# EAGLE design FiltreFSK_TI_LM386 (EAGLE 6.4)
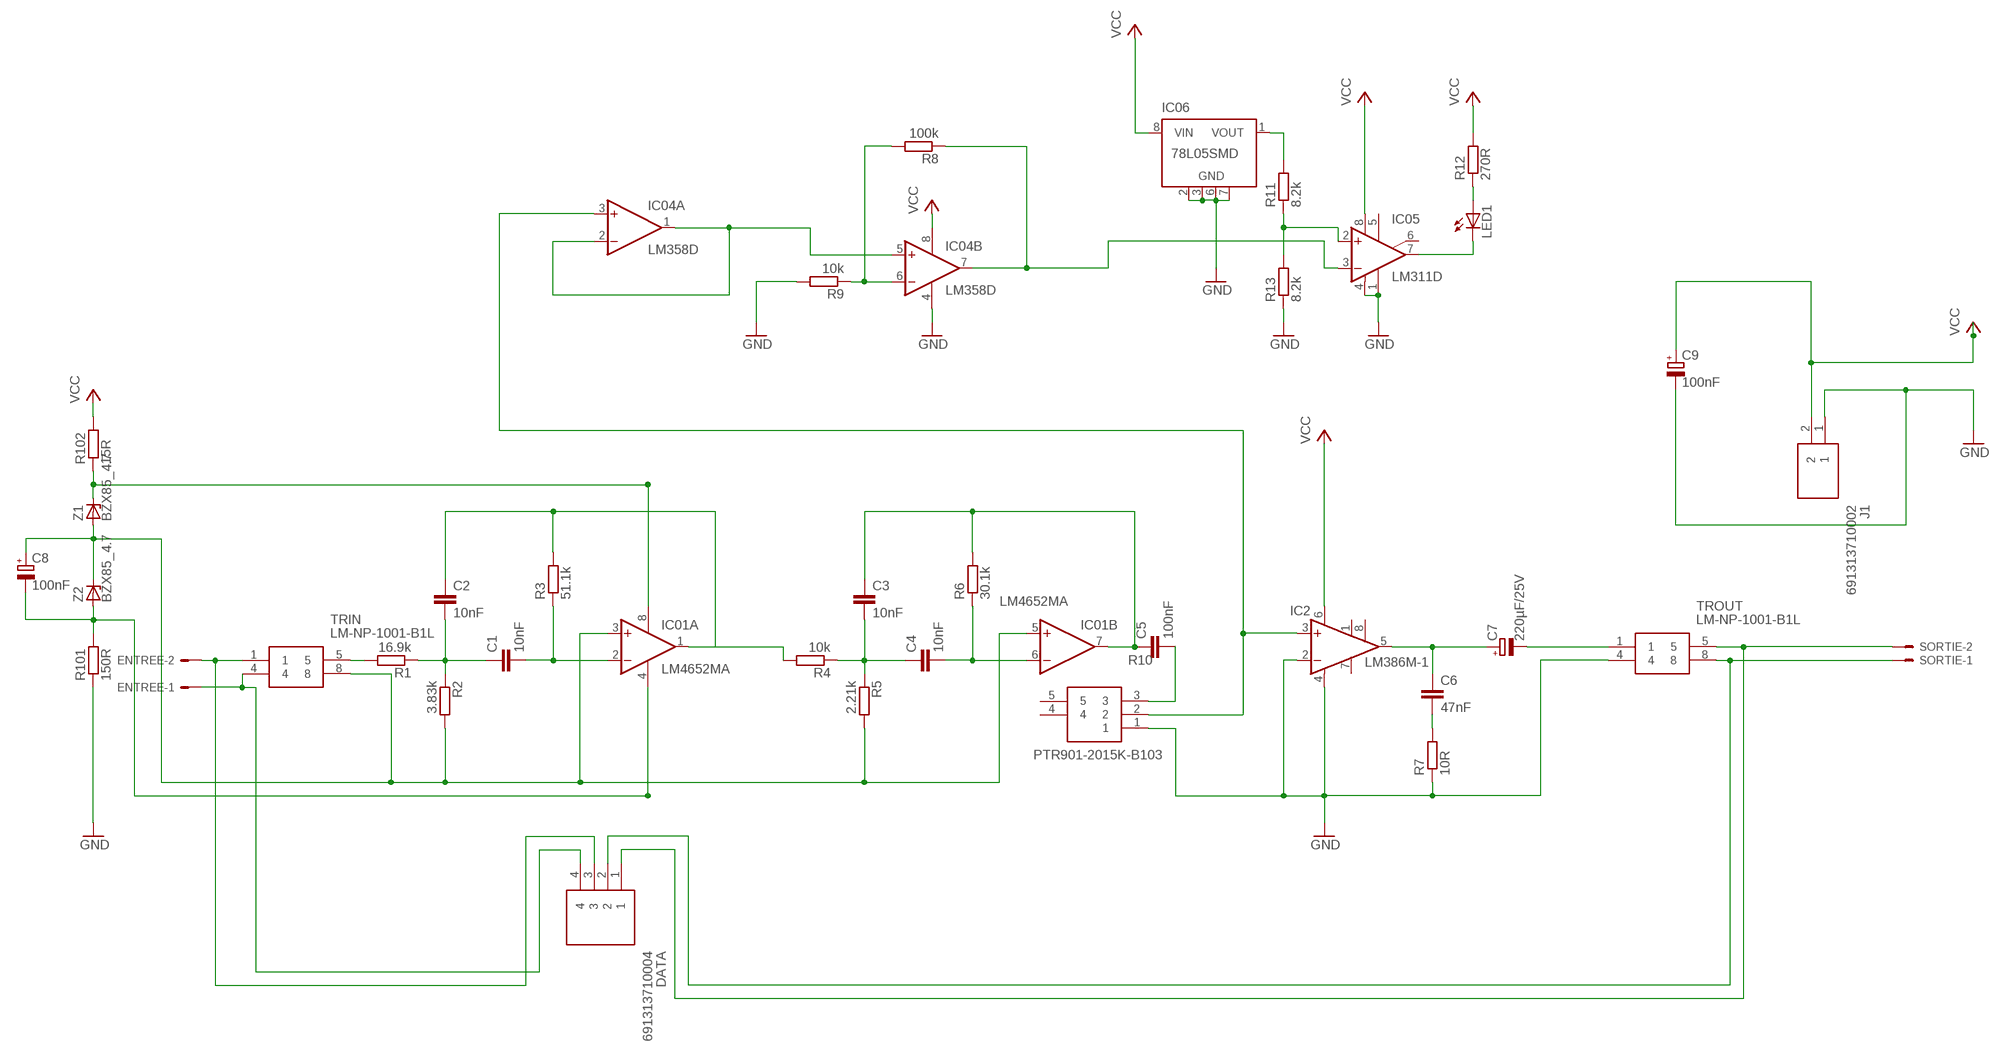
[diagram p0: schematic, sheet 1]

## Parts
C1  10nF  C-EUC1206  [C1206]
C2  10nF  C-EUC1206  [C1206]
C3  10nF  C-EUC1206  [C1206]
C4  10nF  C-EUC1206  [C1206]
C5  100nF  C-EUC1206  [C1206]
C6  47nF  C-EUC1206  [C1206]
C7  220µF/25V  CPOL-EUE3.5-8  [E3,5-8]
C8  100nF  CPOL-EUE5-10.5  [E5-10,5]
C9  100nF  CPOL-EUE5-10.5  [E5-10,5]
DATA  691313710004  [SHDR4W140P0X500_1X4_2200X1200X]
ENTREE  KK-156-2  [KK-156-2]
IC01  LM4652MA  LM358D  [SO08]
IC2  LM386M-1  [SO08]
IC04  LM358D  [SO08]
IC05  LM311D  [SO08]
IC06  78L05SMD  [SO08]
J1  691313710002  [691313710002]
LED1  LED5MM  [LED5MM]
R1  16.9k  R-EU_R1206  [R1206]
R2  3.83k  R-EU_R1206  [R1206]
R3  51.1k  R-EU_R1206  [R1206]
R4  10k  R-EU_R1206  [R1206]
R5  2.21k  R-EU_R1206  [R1206]
R6  30.1k  R-EU_R1206  [R1206]
R7  10R  R-EU_R1206  [R1206]
R8  100k  R-EU_R1206  [R1206]
R9  10k  R-EU_R1206  [R1206]
R10  PTR901-2015K-B103  [PTR9012015KB103]
R11  8.2k  R-EU_R1210  [R1210]
R12  270R  R-EU_R1206  [R1206]
R13  8.2k  R-EU_R1210  [R1210]
R101  150R  R-EU_0207/10  [0207/10]
R102  15R  R-EU_0207/10  [0207/10]
SORTIE  KK-156-2  [KK-156-2]
TRIN  LM-NP-1001-B1L  [LMNP1001B1L]
TROUT  LM-NP-1001-B1L  [LMNP1001B1L]
Z1  BZX85_4.7  BZX85  [DO41Z10]
Z2  BZX85_4.7  BZX85  [DO41Z10]

## Nets
GND: C9.- IC2.2(-IN) IC2.4(GND) IC04.4(P:V-) IC05.1(GND) IC05.4(V-) IC06.2(GND) IC06.3(GND) IC06.6(GND) IC06.7(GND) J1.1 R7.1 R9.2 R10.1 R13.1 R101.1 TROUT.4
N$1: DATA.3 ENTREE.2 TRIN.1
N$2: C8.+ IC01.3(A:+IN) IC01.5(B:+IN) R2.2 R5.2 TRIN.8 Z1.A Z2.C
N$3: C8.- IC01.4(P:V-) R101.2 Z2.A
N$4: C1.1 C2.2 R1.1 R2.1
N$5: C2.1 IC01.1(A:OUT) R3.2 R4.2
N$6: C1.2 IC01.2(A:-IN) R3.1
N$7: DATA.4 ENTREE.1 TRIN.4
N$8: IC2.3(+IN) IC04.3(A:+IN) R10.2
N$9: C6.2 R7.2
N$10: C5.2 R10.3
N$11: DATA.2 SORTIE.1 TROUT.8
N$12: C6.1 C7.+ IC2.5(OUT)
N$13: R1.2 TRIN.5
N$14: C7.- TROUT.1
N$16: IC04.7(B:OUT) IC05.3(-IN) R8.1
N$17: IC01.8(P:V+) R102.1 Z1.C
N$18: IC04.6(B:-IN) R8.2 R9.1
N$19: IC05.7(OUT) LED1.K(C)
N$20: LED1.A R12.1
N$21: IC06.1(VOUT) R11.2
N$22: DATA.1 SORTIE.2 TROUT.5
N$23: IC05.2(+IN) R11.1 R13.2
N$24: IC04.1(A:OUT) IC04.2(A:-IN) IC04.5(B:+IN)
N$30: C3.2 C4.1 R4.1 R5.1
N$31: C3.1 C5.1 IC01.7(B:OUT) R6.2
N$32: C4.2 IC01.6(B:-IN) R6.1
VCC: C9.+ IC2.6(VS) IC04.8(P:V+) IC05.8(V+) IC06.8(VIN) J1.2 R12.2 R102.2
Unconnected: IC2.1(GAIN) IC2.7(BYPASS) IC2.8(GAIN) IC05.5(ON) IC05.6(ON/STR) IC06.4(NC) IC06.5(NC) R10.4 R10.5

## Library data of the parts
C1-C6 = rcl:C-EU: CAPACITOR, European symbol
C7-C9 = rcl:CPOL-EU: POLARIZED CAPACITOR, European symbol
DATA = 691313710004:691313710004: WR-TBL Terminal block - serie 3137 Source: Datasheet <http://katalog.we-online.de/em/datasheet/6913137100xx.pdf>; DESCRIPTION: WR-TBL Terminal block - serie 3137; HEIGHT: 8.7mm; MANUFACTURER_NAME: Wurth Elektronik; MANUFACTURER_PART_NUMBER: 691313710004; MOUSER_PART_NUMBER: 710-691313710004; MOUSER_PRICE-STOCK: https://www.mouser.com/Search/Refine.aspx?Keyword=710-691313710004; RS_PART_NUMBER: 8246576; RS_PRICE-STOCK: http://uk.rs-online.com/web/p/products/8246576
ENTREE SORTIE = con-molex:KK-156-2: KK 156 HEADER Source: http://www.molex.com/pdm_docs/sd/026604100_sd.pdf; OC_FARNELL: unknown; OC_NEWARK: unknown
IC01 IC04 = linear:LM358: OP AMP also LM158; LM258; LM2904 Source: http://cache.national.com/ds/LM/LM158.pdf
IC2 = linear:LM386?-*: Low Voltage Audio Power Amplifier Source: http://cache.national.com/ds/LM/LM386.pdf
IC05 = linear:LM311: COMPARATOR
IC06 = linear:78L*SMD: Positive VOLTAGE REGULATOR
J1 = 691313710002:691313710002: WR-TBL Terminal block - serie 3137 Source: Datasheet <http://katalog.we-online.de/em/datasheet/6913137100xx.pdf>; DESCRIPTION: WR-TBL Terminal block - serie 3137; HEIGHT: 8mm; MANUFACTURER_NAME: Wurth Elektronik; MANUFACTURER_PART_NUMBER: 691313710002; MOUSER_PART_NUMBER: 710-691313710002; MOUSER_PRICE-STOCK: https://www.mouser.co.uk/ProductDetail/Wurth-Elektronik/691313710002/?qs=E2PpAYvlWVvKmc%252BmbMMj0Q%3D%3D
LED1 = led:LED: LED OSRAM: - CHIPLED LG R971, LG N971, LY N971, LG Q971, LY Q971, LO R971, LY R971 LH N974, LH R974 LS Q976, LO Q976, LY Q976 LO Q996 - Hyper CHIPLED LW Q18S LB Q993, LB Q99A, LB R99A - SideLED LS A670, LO A670, LY A670, LG A670, LP A670 LB A673, LV A673, LT A673, LW A673 LH A674 LY A675 LS A676, LA A676, LO A676, LY A676, LW A676 LS A679, LY A679, LG A679 - Hyper Micro SIDELED® LS Y876, LA Y876, LO Y876, LY Y876 LT Y87S - SmartLED LW L88C, LW L88S LB L89C, LB L89S, LG L890 LS L89K, LO L89K, LY L89K LS L896, LA L896, LO L896, LY L896 - TOPLED LS T670, LO T670, LY T670, LG T670, LP T670 LSG T670, LSP T670, LSY T670, LOP T670, LYG T670 LG T671, LOG T671, LSG T671 LB T673, LV T673, LT T673, LW T673 LH T674 LS T676, LA T676, LO T676, LY T676, LB T676, LH T676, LSB T676, LW T676 LB T67C, LV T67C, LT T67C, LS T67K, LO T67K, LY T67K, LW E67C LS E67B, LA E67B, LO E67B, LY E67B, LB E67C, LV E67C, LT E67C LW T67C LS T679, LY T679, LG T679 LS T770, LO T770, LY T770, LG T770, LP T770 LB T773, LV T773, LT T773, LW T773 LH T774 LS E675, LA E675, LY E675, LS T675 LS T776, LA T776, LO T776, LY T776, LB T776 LHGB T686 LT T68C, LB T68C - Hyper Mini TOPLED® LB M676 - Mini TOPLED Santana® LG M470 LS M47K, LO M47K, LY M47K Source: http://www.osram.convergy.de LUXEON: - LUMILED® LXK2-PW12-R00, LXK2-PW12-S00, LXK2-PW14-U00, LXK2-PW14-V00 LXK2-PM12-R00, LXK2-PM12-S00, LXK2-PM14-U00 LXK2-PE12-Q00, LXK2-PE12-R00, LXK2-PE12-S00, LXK2-PE14-T00, LXK2-PE14-U00 LXK2-PB12-K00, LXK2-PB12-L00, LXK2-PB12-M00, LXK2-PB14-N00, LXK2-PB14-P00, LXK2-PB14-Q00 LXK2-PR12-L00, LXK2-PR12-M00, LXK2-PR14-Q00, LXK2-PR14-R00 LXK2-PD12-Q00, LXK2-PD12-R00, LXK2-PD12-S00 LXK2-PH12-R00, LXK2-PH12-S00 LXK2-PL12-P00, LXK2-PL12-Q00, LXK2-PL12-R00 Source: www.luxeon.com KINGBRIGHT: KA-3528ASYC Source: www.kingbright.com
R1-R9 R11-R13 R101 R102 = rcl:R-EU_: RESISTOR, European symbol
R10 = PTR901-2015K-B103:PTR901-2015K-B103: Bourns PTR901-2015K-B103 Rotary Carbon Potentiometer 1 Gang with a 6 mm Dia. Shaft, Through Hole, 10k +/-10%, 0.05W Source: Datasheet <https://www.bourns.com/docs/product-datasheets/PTR90.pdf>; ALLIED_NUMBER: 71279411; ALLIED_PRICE-STOCK: https://www.alliedelec.com/bourns-ptr901-2015k-b103/71279411/; DESCRIPTION: Bourns PTR901-2015K-B103 Rotary Carbon Potentiometer 1 Gang with a 6 mm Dia. Shaft, Through Hole, 10k +/-10%, 0.05W; HEIGHT: mm; MANUFACTURER_NAME: Bourns; MANUFACTURER_PART_NUMBER: PTR901-2015K-B103; MOUSER_PART_NUMBER: 652-PTR901-2015KB103; MOUSER_PRICE-STOCK: https://www.mouser.com/Search/Refine.aspx?Keyword=652-PTR901-2015KB103; RS_PART_NUMBER: 8275003P; RS_PRICE-STOCK: http://uk.rs-online.com/web/p/products/8275003P
TRIN TROUT = LM-NP-1001-B1L:LM-NP-1001-B1L: BOURNS - LM-NP-1001-B1L - TRANSFORMER, LINE-MATCHING 1:1, 2.8H Source: Datasheet <https://www.bourns.com/pdfs/LMNPLP.pdf>; ALLIED_NUMBER: 70154707; ALLIED_PRICE-STOCK: https://www.alliedelec.com/bourns-lm-np-1001-b1l/70154707/; DESCRIPTION: BOURNS - LM-NP-1001-B1L - TRANSFORMER, LINE-MATCHING 1:1, 2.8H; HEIGHT: 12mm; MANUFACTURER_NAME: Bourns; MANUFACTURER_PART_NUMBER: LM-NP-1001-B1L; MOUSER_PART_NUMBER: 652-LM-NP-1001-B1L; MOUSER_PRICE-STOCK: https://www.mouser.com/Search/Refine.aspx?Keyword=652-LM-NP-1001-B1L; RS_PART_NUMBER: 1740620; RS_PRICE-STOCK: http://uk.rs-online.com/web/p/products/1740620
Z1 Z2 = diode:BZX85: Z DIODE

## Board
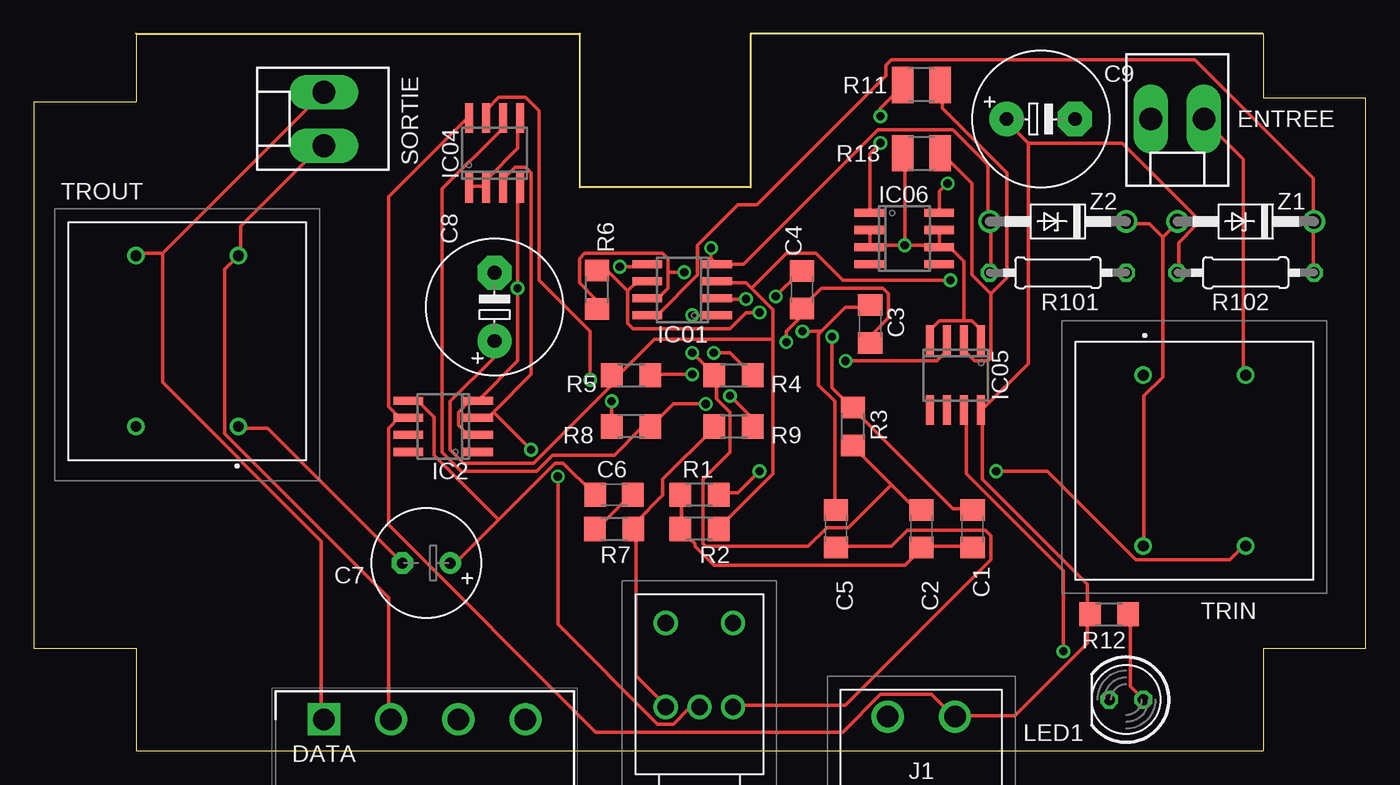
[diagram p1: board, top side]
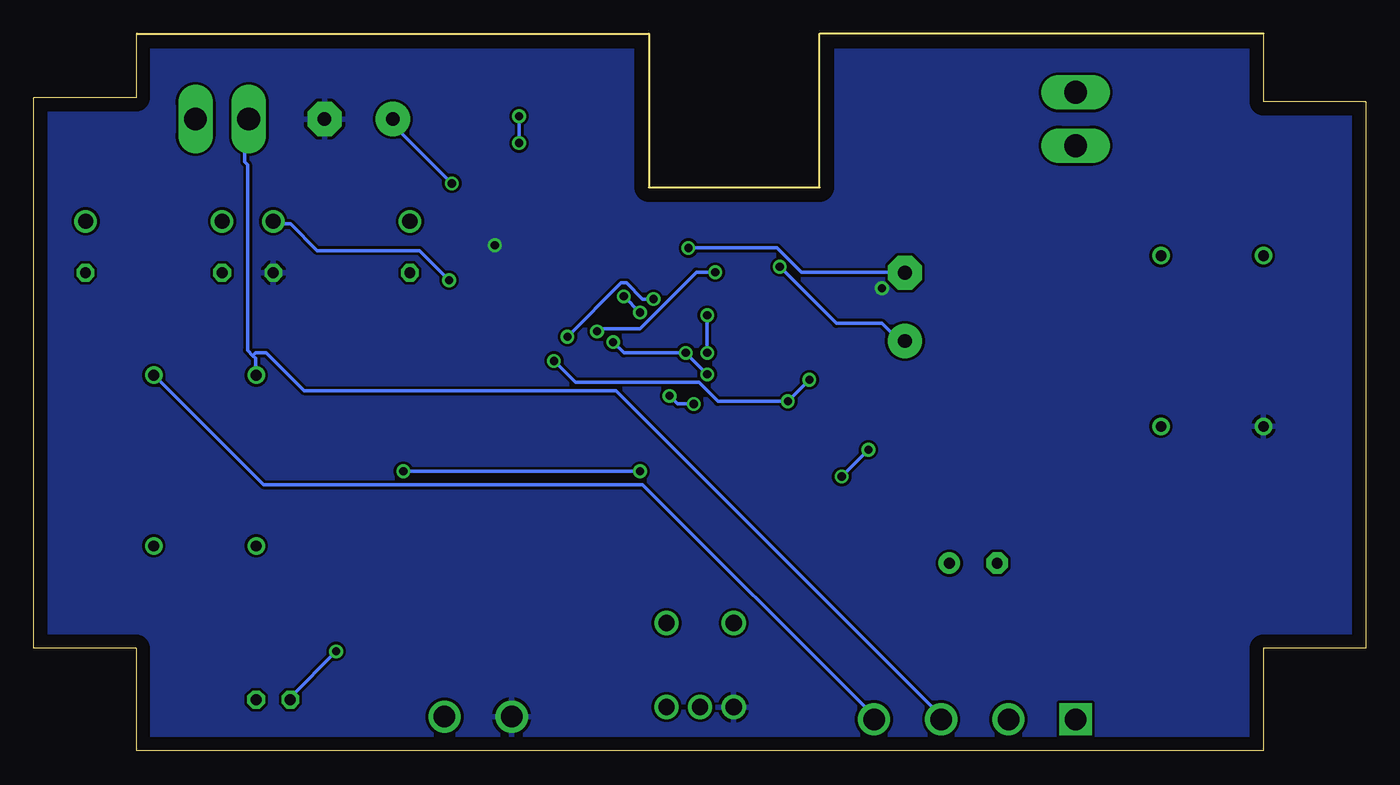
[diagram p2: board, bottom side, seen from below]

Size 99.11 x 53.34 mm. Coordinates in mm from the lower left corner, seen from the top.
Outline: 91.49,53.34 91.49,48.56 99.11,48.56 99.11,7.62 91.49,7.62 91.49,0 7.62,0 7.62,7.62 0,7.62 0,48.26 7.62,48.26 7.62,53.34 40.64,53.34 40.64,41.91 53.34,41.91 53.34,53.34 91.44,53.34
Copper layers (1*16): Top 0.035mm / dielectric 1.5mm / Bottom 0.035mm
Design rules "default": minimum track width 10mil, minimum drill 24mil, track to track 8mil, track to pad 8mil, pad to pad 8mil, via to via 8mil, smd to smd 8mil, copper to edge 40mil, drill to drill 8mil, minimum pad ring 10mil, minimum via ring 8mil, stop-mask expansion 4mil, vias tented up to drill 0mil, thermal gap 10mil

### Footprints (pad centres in the part's own frame; a part is rotated, then mirrored left to right if it is on the bottom)
C1206 = smd 1.6 x 1.8: 1 -1.4,0; 2 1.4,0
E3,5-8 = drill 0.813 pad 1.6: + -1.778,0 | drill 0.813 pad 1.6 octagon: - 1.778,0
E5-10,5 = drill 1.016 pad 2.54: + -2.54,0 | drill 1.016 pad 2.54 octagon: - 2.54,0
SHDR4W140P0X500_1X4_2200X1200X = drill 1.6 pad 2.4 square: 1 0,0 | drill 1.6 pad 2.4: 2 5,0; 3 10,0; 4 15,0
KK-156-2 = drill 1.7 pad 2.184 long: 1 -1.98,0; 2 1.98,0
SO08 = smd 0.6 x 2.2: 1 -1.905,-2.6; 2 -0.635,-2.6; 3 0.635,-2.6; 4 1.905,-2.6; 5 1.905,2.6; 6 0.635,2.6; 7 -0.635,2.6; 8 -1.905,2.6
691313710002 = drill 1.6 pad 2.4: 1 -2.5,4.005; 2 2.5,4.005
LED5MM = drill 0.813 octagon: A -1.27,0; K 1.27,0
R1206 = smd 1.6 x 1.803: 1 -1.422,0; 2 1.422,0
PTR9012015KB103 = drill 1.2 pad 1.8: 1 -5.8,-2.5; 2 -5.8,0; 3 -5.8,2.5; 4 -12.05,-2.5; 5 -12.05,2.5
R1210 = smd 1.6 x 2.7: 1 -1.4,0; 2 1.4,0
0207/10 = drill 0.813 octagon: 1 -5.08,0; 2 5.08,0
LMNP1001B1L = drill 0.8 pad 1.3: 1 3.81,-6.35; 4 -3.81,-6.35; 5 -3.81,6.35; 8 3.81,6.35
DO41Z10 = drill 1.118: A 5.08,0; C -5.08,0

### Placement (x,y rotation side)
C1  69.85,16.51 90 top
C2  66.04,16.51 270 top
C3  62.23,31.75 270 top
C4  57.15,34.29 90 top
C5  59.69,16.51 270 top
C6  43.18,19.05 0 top
C7  29.21,13.97 180 top
C8  34.29,33.02 90 top
C9  74.93,46.99 0 top
DATA  21.59,2.35 0 top
ENTREE  85.09,46.99 180 top
IC01  48.26,34.29 90 top
IC2  30.48,24.13 90 top
IC04  34.29,44.45 0 top
IC05  68.58,27.94 180 top
IC06  64.77,38.1 270 top
J1  66.04,-1.46 0 top
LED1  81.28,3.81 180 top
R1  49.53,19.05 0 top
R2  49.53,16.51 0 top
R3  60.96,24.13 270 top
R4  52.07,27.94 180 top
R5  44.45,27.94 180 top
R6  41.91,34.29 270 top
R7  43.18,16.51 180 top
R8  44.45,24.13 0 top
R9  52.07,24.13 180 top
R10  49.53,-2.54 270 top
R11  66.04,49.53 180 top
R12  80.01,10.16 180 top
R13  66.04,44.45 0 top
R101  76.2,35.56 180 top
R102  90.17,35.56 180 top
SORTIE  21.59,46.99 90 top
TRIN  86.36,21.59 180 top
TROUT  11.43,30.48 0 top
Z1  90.17,39.37 180 top
Z2  76.2,39.37 180 top

### Tracks (layer width: path | path; a pad name or v marks a point on that pad's centre or on a via)
GND  (via drill 0.61)
  Top 0.254: 69.2,32 69.8,32 70.4,31.4 70.4,30.6 IC05.1 | 69.2,32 67.4,32 66.8,31.4 66.8,30.6 IC05.4 | 62.2,37.6 62.2,38.6 IC06.2 | IC06.6 67.4,37.6 67.4,38.6 IC06.7 | v64.8,37.6 67.2,37.6 IC06.6 | v64.8,37.6 62.2,37.6 | 62.2,37.6 IC06.3 | v64.8,37.6 64.8,44.4 R13.1 | 69.2,32 69.2,36.4 68.2,37.4 67.4,37.4 IC06.6 | IC2.2 33,23.6 32.2,23.6 31.6,24.2 31.6,25.2 32.4,26 33,26 IC2.4 33.2,26.2 36,29 v36,34.4 36,41.8 IC04.4 | R9.2 50.6,24 46.8,20.2 46.8,19 44.8,17 44.8,16.6 R7.1 44.8,16.4 44.8,5.6 47,3.4 R10.1
  pour Bottom: 0,53.46 99.11,53.46 99.11,0 0,0
N$1
  Bottom 0.254: 82.8,29.4 83.2,29.8 83.2,43.6 83.4,43.8 83.4,46.6 83.2,46.8 ENTREE.2 | 82.8,29.4 82.6,29.2 82.6,28 TRIN.1 | 82.8,29.4 82.6,29.6 81.8,29.6 79,26.8 55.8,26.8 32.2,3.2 32.2,3 31.6,2.4 DATA.3
N$2  (via drill 0.61)
  Top 0.254: 84,38.2 84,27.8 82.6,26.4 82.6,15.4 TRIN.8 | 84,38.2 85,39.2 Z1.A | 84,38.2 83,39.2 81.4,39.2 Z2.C | v43.6,36 45.6,36 IC01.5 | 55,30.6 55,32.8 53.4,34.4 | 55,30.6 55,20.6 51,16.6 R2.2 | 53.4,34.4 53,34.8 51,34.8 IC01.3 | 55,30.6 46.2,30.6 43.6,28 43.2,28 R5.2 43,27.8 43,27.2 37.2,21.4 32,21.4 31,22.4 31,26 34.2,29.2 34.2,30.4 C8.+ | v68.2,35 60.2,35 58.2,37 56,37 53.4,34.4
  Bottom 0.254: v43.6,36 39.4,31.8 36,31.8 34.8,30.6 34.4,30.6 C8.+ | v68.2,35 70.4,37.2 78,37.2 80,39.2 81.2,39.2 Z2.C
N$3  (via drill 0.61)
  Top 0.254: R101.2 71.2,35.6 71.2,39.2 Z2.A 71,39.4 71,43.6 68.4,46.2 62.8,46.2 52.8,36.2 51,36.2 IC01.4 50.8,36.2 50.4,36.6 v50.4,37.4
  Bottom 0.254: v50.4,37.4 43.8,37.4 42,35.6 34.4,35.6 C8.-
N$4
  Top 0.254: R1.1 48.2,19 48.2,16.6 R2.1 48.2,16.4 49.2,15.4 49.2,15.2 50.6,13.8 64.8,13.8 66,15 C2.2 66.2,15.2 69.8,15.2 C1.1
N$5  (via drill 0.61)
  Top 0.254: 63.8,19.8 61,22.6 R3.2 | 63.8,19.8 65.6,18 66,18 C2.1 | 63.8,19.8 60.6,16.6 59,16.6 57.6,15.2 50,15.2 49.8,15.4 49.8,20.2 51.8,22.2 51.8,25.2 50.8,26.2 50.8,27.8 R4.2 50.6,28 v49,29.6 | v49,32.4 50.8,32.4 IC01.1
  Bottom 0.254: v49,29.6 v49,32.4
N$6  (via drill 0.61)
  Top 0.254: C1.2 69.8,18 68.4,18 61,25.4 R3.1 60.8,25.6 59.4,27 v59.4,30.8 | v53,33.6 51,33.6 IC01.2
  Bottom 0.254: v53,33.6 53.8,33.6 55,34.8 55.4,34.8 v59.4,30.8
N$7
  Top 0.254: TRIN.4 90,28 90,44 87.2,46.8 ENTREE.1
  Bottom 0.254: DATA.4 36.6,2.4 37.2,3 37.2,3.2 53.8,19.8 82,19.8 90,27.8 TRIN.4
N$8  (via drill 0.61)
  Top 0.254: 34.2,25.2 37,28 37,43 36.6,43.4 35.8,43.4 35,42.6 35,42 IC04.3 | 34.2,25.2 33.8,24.8 33.2,24.8 IC2.3 | v39,20.4 39,9.4 46.4,2 47.6,2 48.8,3.2 49.4,3.2 R10.2 | 34.2,25.2 v37,22.4
  Bottom 0.254: v37,22.4 v39,20.4
N$9
  Top 0.254: C6.2 44.4,19 41.8,16.4 R7.2
N$10
  Top 0.254: C5.2 59.8,15.2 63.8,15.2 65,16.4 70.8,16.4 71.2,16 71.2,14.2 60.4,3.4 52.2,3.4 R10.3
N$11
  Top 0.254: SORTIE.1 21.4,45 15.4,39 15.4,37 TROUT.8 15.2,36.8 14.2,35.8 14.2,23.6 26.4,11.4 26.4,2.4 DATA.2
N$12
  Top 0.254: 34.6,17.2 31.4,14 31,14 C7.+ | 34.6,17.2 38.8,21.4 39.4,21.4 41.6,19.2 C6.1 | 34.6,17.2 29.8,22 29.8,24.8 28.6,26 28,26 IC2.5
N$13  (via drill 0.61)
  Top 0.254: v54,20.8 52.4,19.2 51,19.2 R1.2 | v71.6,20.8 75.4,20.8 82,14.2 89,14.2 90,15.2 TRIN.5
  Bottom 0.254: v71.6,20.8 v54,20.8
N$14
  Top 0.254: TROUT.1 15.4,24 17.4,24 27.4,14 C7.-
N$16  (via drill 0.61)
  Top 0.254: v43,26 43,24.2 R8.1 | v41.4,27.6 41.4,31.2 37.6,35 37.6,47.6 36.6,48.6 34.6,48.6 33.8,47.8 33.8,47.2 IC04.7 | v60.4,29 67.2,29 67.8,29.6 67.8,30.4 IC05.3
  Bottom 0.254: v41.4,27.6 v43,26 48.2,26 49.6,27.4 58.8,27.4 v60.4,29
N$17
  Top 0.254: IC01.8 45.8,32.4 46.4,32.4 49.4,35.4 49.4,37.6 52.4,40.6 53.8,40.6 63.4,50.2 63.4,51 63.8,51.4 86.4,51.4 95.2,42.6 95.2,39.4 Z1.C 95.2,39.2 95.2,35.6 R102.1
N$18  (via drill 0.61)
  Top 0.254: IC04.6 34.8,47 34.8,46.2 30.4,41.8 30.4,22.2 31.8,20.8 37.4,20.8 38.6,22 43.2,22 45.2,24 45.8,24 R8.2 46,24.2 47.6,25.8 v50,25.8 | v51.8,26.4 53.4,24.8 53.4,24.2 R9.1
  Bottom 0.254: v51.8,26.4 51.2,25.8 v50,25.8
N$19  (via drill 0.61)
  Top 0.254: v76.6,7.4 76.6,13.4 69.4,20.6 69.4,25.2 IC05.7
  Bottom 0.254: v76.6,7.4 80,4 LED1.K
N$20
  Top 0.254: R12.1 81.6,10 81.6,4.8 82.4,4 LED1.A
N$21  (via drill 0.61)
  Top 0.254: v63,45.2 62.2,44.4 62.2,40.2 IC06.1 | v63,47.2 63,47.8 64.6,49.4 R11.2
  Bottom 0.254: v63,47.2 v63,45.2
N$22
  Top 0.254: 9.6,37 7.8,37 TROUT.5 | 9.6,37 21.4,48.8 SORTIE.2 | 9.6,37 9.6,27.4 21.4,15.6 21.4,2.4 DATA.1
N$23
  Top 0.254: 71.2,34 71.2,29.2 71,29 70,29 69.4,29.6 69.4,30.4 IC05.2 | 71.2,34 69.8,35.4 69.8,42.2 67.6,44.4 R13.2 | 71.2,34 72.4,35.2 72.4,43 67.6,47.8 67.6,49.4 R11.1
N$24
  Top 0.254: IC04.1 32.4,42 33.6,42 IC04.2 33.8,42 33.8,42.6 36,44.8 36,47 IC04.5
N$30  (via drill 0.61)
  Top 0.254: C3.2 62.4,30.4 62.4,31 63.6,32.2 63.6,34 63.2,34.4 58.6,34.4 57.2,33 C4.1 57,32.8 57,32.2 56,31.2 v56,30.4 | v49,28 46,28 R5.1 | v50.6,29.6 51.8,29.6 53.4,28 R4.1
  Bottom 0.254: v49,28 v50.6,29.6 55.2,29.6 v56,30.4
N$31  (via drill 0.61)
  Top 0.254: 47.2,35.6 47.2,34.4 46.6,33.8 45.8,33.8 IC01.7 | 47.2,35.6 47.2,36.6 46.8,37 41,37 40.6,36.6 40.6,34.8 41.8,33.6 41.8,33 R6.2 | 58.6,31.2 60.4,33 62.2,33 C3.1 | 58.6,31.2 58.4,31 58.4,27.2 59.6,26 59.6,18 C5.1 | v48.4,35.6 47.2,35.6 | 58.6,31.2 v57.2,31.2
  Bottom 0.254: v48.4,35.6 49.8,35.6 54,31.4 57,31.4 v57.2,31.2
N$32  (via drill 0.61)
  Top 0.254: v55.2,33.8 57,35.6 C4.2 | v54,32.6 53,32.6 51.8,31.4 44.6,31.4 44.2,31.8 44.2,34.2 | 44.2,34.2 44.8,34.8 45.6,34.8 IC01.6 | 44.2,34.2 42.8,35.6 42,35.6 R6.1
  Bottom 0.254: v54,32.6 v55.2,33.8
VCC  (via drill 0.61)
  Top 0.254: v68,42.2 67.4,41.6 67.4,40.2 IC06.8 | 74,45.2 81,45.2 86.4,39.8 86.4,39 85.2,37.8 85.2,35.6 R102.2 | 74,45.2 72.4,46.8 C9.+ | 27.2,24.8 27.8,24.8 IC2.6 27.2,24.8 | 27.2,24.8 26.4,25.6 26.4,41.2 32.2,47 IC04.8 | 27.2,24.8 26.4,24 26.4,16.8 41.8,1.4 60.2,1.4 63,4.2 66.8,4.2 68.4,2.6 J1.2 68.6,2.6 73,2.6 78.4,8 78.4,10 R12.2 78.4,10.2 78.4,12.4 70.6,20.2 70.6,25.2 IC05.8 70.6,25.4 74,28.8 74,45.2
  Bottom 0.254: v68,42.2 72.2,46.4 72.2,46.8 C9.+

### Text on the board
Document: Filtre FSK +25dB / Météo-France/DSO/DOS/Capteurs / V1.2.1
tDocu: GND 12V | OUT | IN